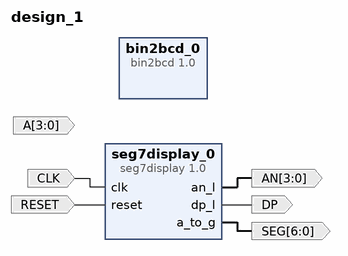
[diagram p0: block diagram of the top level]
# Vivado block design design_1, xc7a35tcpg236-1, Vivado 2023.1
create_bd_design design_1

create_bd_port -dir O -from 3 -to 0 AN
create_bd_port -dir O -from 6 -to 0 SEG
create_bd_port -dir O DP
create_bd_port -dir I -type clk CLK
set_property -dict {CONFIG.FREQ_HZ 10000000} [get_bd_ports CLK]
create_bd_port -dir I -type rst RESET
set_property -dict {CONFIG.POLARITY ACTIVE_HIGH} [get_bd_ports RESET]
create_bd_port -dir I -from 3 -to 0 A

create_bd_cell -type ip -vlnv xilinx.com:XUP:seg7display:1.0 seg7display_0
create_bd_cell -type ip -vlnv xilinx.com:XUP:bin2bcd:1.0 bin2bcd_0
set_property -dict {CONFIG.SIZE 4} [get_bd_cells bin2bcd_0]

# ---- connections ----

connect_bd_net [get_bd_ports CLK] [get_bd_pins seg7display_0/clk]
connect_bd_net [get_bd_ports RESET] [get_bd_pins seg7display_0/reset]
connect_bd_net [get_bd_pins seg7display_0/a_to_g] [get_bd_ports SEG]
connect_bd_net [get_bd_pins seg7display_0/an_l] [get_bd_ports AN]
connect_bd_net [get_bd_pins seg7display_0/dp_l] [get_bd_ports DP]

validate_bd_design
save_bd_design
